# EAGLE design pc-link (EAGLE 9.1.3)
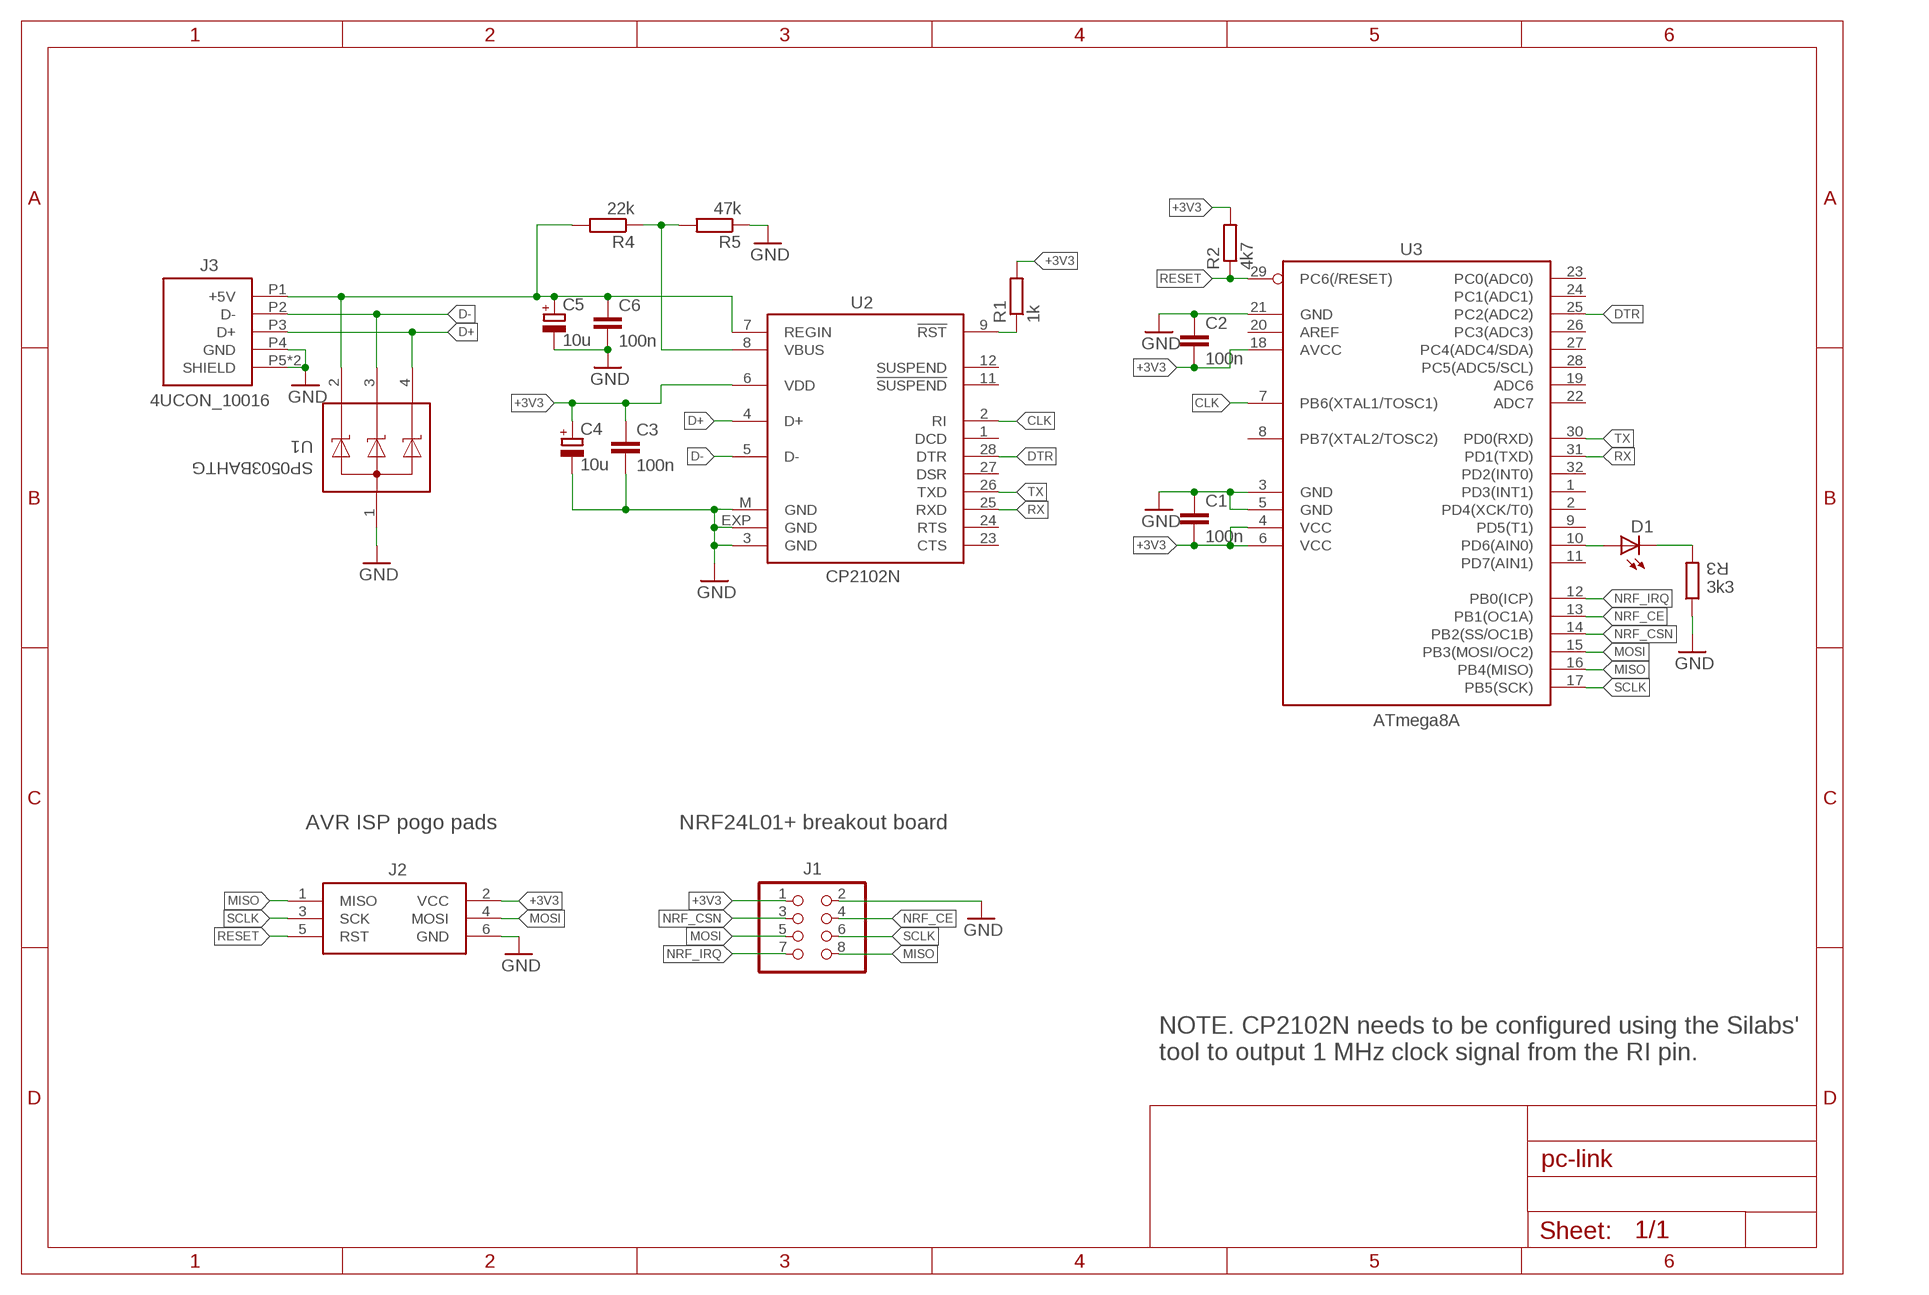
[diagram p0: schematic, sheet 1]

## Parts
C1  100n  C-EUC0805  [C0805]
C2  100n  C-EUC0805  [C0805]
C3  100n  C-EUC0805  [C0805]
C4  10u  CPOL-EUCT3216  [CT3216]
C5  10u  CPOL-EUCT3216  [CT3216]
C6  100n  C-EUC0805  [C0805]
D1  LEDSMT1206  [1206]
J1  PINHD-2X4  [2X04]
J2  POGO_AVR_ISP6  [POGO_AVR_ISP6]
J3  4UCON_10016  USB_A_4UCON_10016  [USB_A_4UCON_10016]
R1  1k  R-EU_R0805  [R0805]
R2  4k7  R-EU_R0805  [R0805]
R3  3k3  R-EU_R0805  [R0805]
R4  22k  R-EU_R0805  [R0805]
R5  47k  R-EU_R0805  [R0805]
U1  SP0503BAHTG  [SOT143]
U2  CP2102N  CP2102  [MLP28]
U3  ATmega8A  MEGA8-AI  [TQFP32-08]

## Nets
+3V3: C1.2 C2.2 C3.1 C4.+ J1.1 J2.2(VCC) R1.2 R2.2 U2.6(VDD) U3.4(VCC) U3.6(VCC) U3.18(AVCC)
+5V: C5.+ C6.1 J3.P1(+5V) R4.2 U1.2 U2.7(REGIN)
CLK: U2.2(RI) U3.7(PB6(XTAL1/TOSC1))
D+: J3.P3(D+) U1.4 U2.4(D+)
D-: J3.P2(D-) U1.3 U2.5(D-)
DTR: U2.28(DTR) U3.25(PC2(ADC2))
GND: C1.1 C2.1 C3.2 C4.- C5.- C6.2 J1.2 J2.6(GND) J3.P4(GND) J3.P5(SHIELD) J3.P6(SHIELD) R3.1 R5.1 U1.1 U2.3(GND) U2.EXP(GND) U2.M(GND) U3.3(GND) U3.5(GND) U3.21(GND)
MISO: J1.8 J2.1(MISO) U3.16(PB4(MISO))
MOSI: J1.5 J2.4(MOSI) U3.15(PB3(MOSI/OC2))
N$1: R1.1 U2.9(!RST)
N$2: D1.C R3.2
N$4: D1.A U3.10(PD6(AIN0))
N$5: R4.1 R5.2 U2.8(VBUS)
NRF_CE: J1.4 U3.13(PB1(OC1A))
NRF_CSN: J1.3 U3.14(PB2(SS/OC1B))
NRF_IRQ: J1.7 U3.12(PB0(ICP))
RESET: J2.5(RST) R2.1 U3.29(PC6(/RESET))
RX: U2.25(RXD) U3.31(PD1(TXD))
SCLK: J1.6 J2.3(SCK) U3.17(PB5(SCK))
TX: U2.26(TXD) U3.30(PD0(RXD))
Unconnected: U2.1(DCD) U2.11(!SUSPEND) U2.12(SUSPEND) U2.23(CTS) U2.24(RTS) U2.27(DSR) U3.1(PD3(INT1)) U3.2(PD4(XCK/T0)) U3.8(PB7(XTAL2/TOSC2)) U3.9(PD5(T1)) U3.11(PD7(AIN1)) U3.19(ADC6) U3.20(AREF) U3.22(ADC7) U3.23(PC0(ADC0)) U3.24(PC1(ADC1)) U3.26(PC3(ADC3)) U3.27(PC4(ADC4/SDA)) U3.28(PC5(ADC5/SCL)) U3.32(PD2(INT0))

## Notes on the sheet
- AVR ISP pogo pads | NRF24L01+ breakout board
- NOTE. CP2102N needs to be configured using the Silabs'
  tool to output 1 MHz clock signal from the RI pin.

## Library data of the parts
C1-C3 C6 = rcl:C-EU: CAPACITOR, European symbol; SPICEPREFIX: C
C4 C5 = rcl:CPOL-EU: POLARIZED CAPACITOR, European symbol; SPICEPREFIX: C
D1 = led:LED: LED OSRAM: - CHIPLED LG R971, LG N971, LY N971, LG Q971, LY Q971, LO R971, LY R971 LH N974, LH R974 LS Q976, LO Q976, LY Q976 LO Q996 - Hyper CHIPLED LW Q18S LB Q993, LB Q99A, LB R99A - SideLED LS A670, LO A670, LY A670, LG A670, LP A670 LB A673, LV A673, LT A673, LW A673 LH A674 LY A675 LS A676, LA A676, LO A676, LY A676, LW A676 LS A679, LY A679, LG A679 - Hyper Micro SIDELED® LS Y876, LA Y876, LO Y876, LY Y876 LT Y87S - SmartLED LW L88C, LW L88S LB L89C, LB L89S, LG L890 LS L89K, LO L89K, LY L89K LS L896, LA L896, LO L896, LY L896 - TOPLED LS T670, LO T670, LY T670, LG T670, LP T670 LSG T670, LSP T670, LSY T670, LOP T670, LYG T670 LG T671, LOG T671, LSG T671 LB T673, LV T673, LT T673, LW T673 LH T674 LS T676, LA T676, LO T676, LY T676, LB T676, LH T676, LSB T676, LW T676 LB T67C, LV T67C, LT T67C, LS T67K, LO T67K, LY T67K, LW E67C LS E67B, LA E67B, LO E67B, LY E67B, LB E67C, LV E67C, LT E67C LW T67C LS T679, LY T679, LG T679 LS T770, LO T770, LY T770, LG T770, LP T770 LB T773, LV T773, LT T773, LW T773 LH T774 LS E675, LA E675, LY E675, LS T675 LS T776, LA T776, LO T776, LY T776, LB T776 LHGB T686 LT T68C, LB T68C - Hyper Mini TOPLED® LB M676 - Mini TOPLED Santana® LG M470 LS M47K, LO M47K, LY M47K Source: http://www.osram.convergy.de LUXEON: - LUMILED® LXK2-PW12-R00, LXK2-PW12-S00, LXK2-PW14-U00, LXK2-PW14-V00 LXK2-PM12-R00, LXK2-PM12-S00, LXK2-PM14-U00 LXK2-PE12-Q00, LXK2-PE12-R00, LXK2-PE12-S00, LXK2-PE14-T00, LXK2-PE14-U00 LXK2-PB12-K00, LXK2-PB12-L00, LXK2-PB12-M00, LXK2-PB14-N00, LXK2-PB14-P00, LXK2-PB14-Q00 LXK2-PR12-L00, LXK2-PR12-M00, LXK2-PR14-Q00, LXK2-PR14-R00 LXK2-PD12-Q00, LXK2-PD12-R00, LXK2-PD12-S00 LXK2-PH12-R00, LXK2-PH12-S00 LXK2-PL12-P00, LXK2-PL12-Q00, LXK2-PL12-R00 Source: www.luxeon.com KINGBRIGHT: KA-3528ASYC Source: www.kingbright.com
J1 = pinhead:PINHD-2X4: PIN HEADER
J2 = my:POGO_AVR_ISP6
J3 = my:USB_A_4UCON_10016
R1-R5 = rcl:R-EU_: RESISTOR, European symbol; SPICEPREFIX: R
U1 = my:SP0503BAHTG
U2 = silabs:CP210*: Single-Chip USB to UART Bridge Source: www.silabs.com .. CP2101.pdf / cp2102.pdf; MF: FARNELL; MPN: CP2102-GM; OC_FARNELL: 9282130; OC_NEWARK: 30K5635
U3 = atmel:MEGA8: MICROCONTROLLER 8 Kbytes FLASH, 1 kbytes SRAM, 512 bytes EEPROM, USART, 6-channel 10 bit ADC, 2-channel 8 bit ADC Pin compatible with Atmega48, ATMega88, ATMega168 Source: avr.lbr; MPN: ATMEGA8-16AU; OC_FARNELL: 9171371; OC_NEWARK: 73M8863

## Board
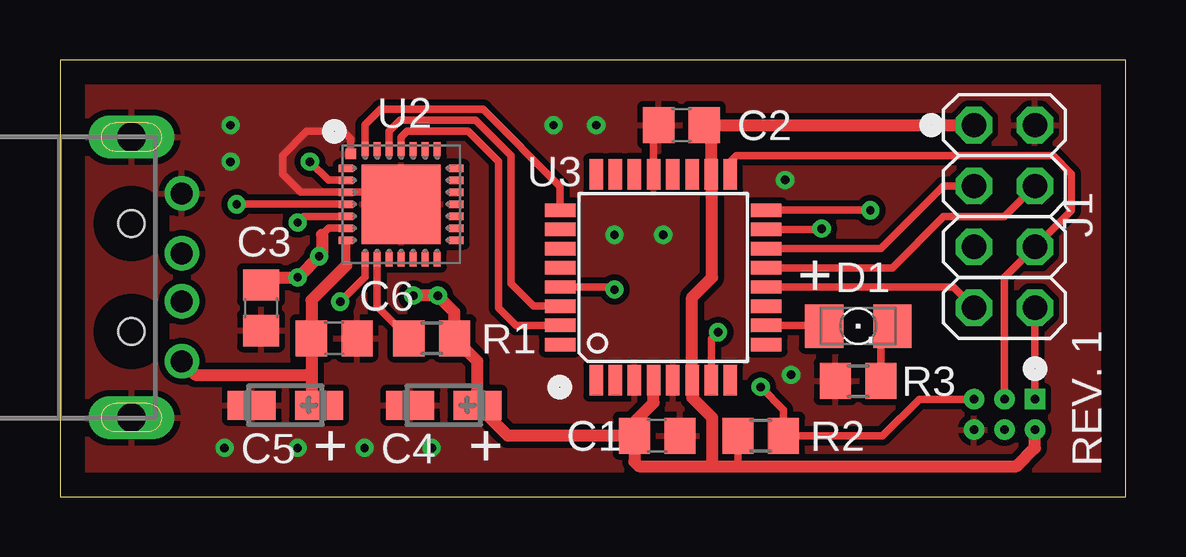
[diagram p1: board, top side]
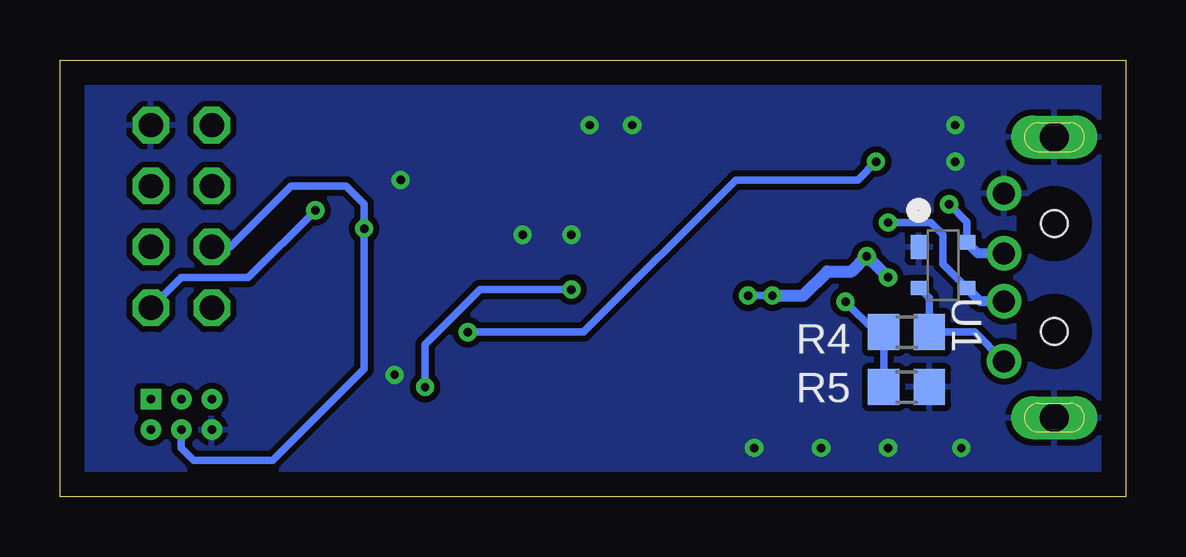
[diagram p2: board, bottom side, seen from below]

Size 44.43 x 18.21 mm. Coordinates in mm from the lower left corner, seen from the top.
Outline: 0,0 44.43,0 44.43,18.21 0,18.21 0,0
Copper layers (1*16): Top 0.035mm / dielectric 1.5mm / Bottom 0.035mm
Design rules "default": minimum track width 6mil, minimum drill 0.35mm, track to track 6mil, track to pad 6mil, pad to pad 6mil, via to via 6mil, smd to smd 6mil, copper to edge 40mil, drill to drill 6mil, minimum pad ring 10mil, minimum via ring 8mil, stop-mask expansion 4mil, vias tented up to drill 0mil, thermal gap 10mil

### Footprints (pad centres in the part's own frame; a part is rotated, then mirrored left to right if it is on the bottom)
C0805 = smd 1.3 x 1.5: 1 -0.95,0; 2 0.95,0
CT3216 = smd 2 x 1.2: + -1.4,0; - 1.4,0
1206 = smd 1.6 x 1.803: A -1.422,0; C 1.422,0
2X04 = drill 1.016 octagon: 1 -3.81,-1.27; 2 -3.81,1.27; 3 -1.27,-1.27; 4 -1.27,1.27; 5 1.27,-1.27; 6 1.27,1.27; 7 3.81,-1.27; 8 3.81,1.27
POGO_AVR_ISP6 = drill 0.35 square: 1 0,0 | drill 0.35: 2 1.27,0; 3 0,-1.27; 4 1.27,-1.27; 5 0,-2.54; 6 1.27,-2.54
USB_A_4UCON_10016 = drill 0.92: P1 -3.5,0; P2 -1,0; P3 1,0; P4 3.5,0 | drill 1.2 long: P5 -5.85,2.1; P6 5.85,2.1 | hole 1.1: 2.25,2.1; -2.25,2.1
R0805 = smd 1.3 x 1.5: 1 -0.95,0; 2 0.95,0
SOT143 = smd 1 x 0.7: 1 -0.75,-1 | smd 0.6 x 0.7: 2 0.95,-1; 3 0.95,1; 4 -0.95,1
MLP28 = smd 0.6 x 0.3: 1 -2.3,1.5; 2 -2.3,1; 3 -2.3,0.5; 4 -2.3,0; 5 -2.3,-0.5; 6 -2.3,-1; 7 -2.3,-1.5; 15 2.3,-1.5; 16 2.3,-1; 17 2.3,-0.5; 18 2.3,0; 19 2.3,0.5; 20 2.3,1; 21 2.3,1.5 | smd 0.3 x 0.6: 8 -1.5,-2.3; 9 -1,-2.3; 10 -0.5,-2.3; 11 0,-2.3; 12 0.5,-2.3; 13 1,-2.3; 14 1.5,-2.3; 22 1.5,2.3; 23 1,2.3; 24 0.5,2.3; 25 0,2.3; 26 -0.5,2.3; 27 -1,2.3; 28 -1.5,2.3 | smd 3.3 x 3.3: EXP 0,0 | smd 0.435 x 0.435: M -2.103,2.103
TQFP32-08 = smd 1.27 x 0.559: 1 -4.293,2.8; 2 -4.293,2; 3 -4.293,1.2; 4 -4.293,0.4; 5 -4.293,-0.4; 6 -4.293,-1.2; 7 -4.293,-2; 8 -4.293,-2.8; 17 4.293,-2.8; 18 4.293,-2; 19 4.293,-1.2; 20 4.293,-0.4; 21 4.293,0.4; 22 4.293,1.2; 23 4.293,2; 24 4.293,2.8 | smd 0.559 x 1.27: 9 -2.8,-4.293; 10 -2,-4.293; 11 -1.2,-4.293; 12 -0.4,-4.293; 13 0.4,-4.293; 14 1.2,-4.293; 15 2,-4.293; 16 2.8,-4.293; 25 2.8,4.293; 26 2,4.293; 27 1.2,4.293; 28 0.4,4.293; 29 -0.4,4.293; 30 -1.2,4.293; 31 -2,4.293; 32 -2.8,4.293

### Placement (x,y rotation side)
C1  24.89,2.54 180 top
C2  25.91,15.49 0 top
C3  8.38,7.87 270 top
C4  16,3.81 180 top
C5  9.4,3.81 180 top
C6  11.43,6.6 0 top
D1  33.27,7.11 0 top
J1  39.37,11.68 270 top
J2  40.64,4.06 270 top
J3  5.08,9.14 90 top
R1  15.49,6.6 0 top
R2  29.21,2.54 180 top
R3  33.27,4.83 0 top
R4  9.14,6.86 0 bottom
R5  9.14,4.57 180 bottom
U1  7.62,9.65 270 bottom
U2  14.22,12.19 0 top
U3  25.15,9.14 90 top

### Tracks (layer width: path | path; a pad name or v marks a point on that pad's centre or on a via)
+3V3  (via drill 0.35)
  Top 0.305: 27.15,15.21 C2.2 | 27.18,13.4 U3.18 | v9.92,9.14 v9.91,9.14 | U2.6 11.19,11.19 10.92,10.92 | 10.92,10.15 v10.8,10.03 | R2.2 28.26,1.34 28.19,1.27
  Top 0.508: U3.18 27.15,15.21 | C1.2 18.67,2.54 C4.+ 17.4,5.65 R1.2 16.44,7.69 v15.75,8.38 v14.73,8.38 | 27.18,13.4 27.18,9.14 26.35,8.31 U3.6 26.35,4.13 27.18,3.3 27.18,1.27 | C1.2 23.94,1.46 24.13,1.27 27.18,1.27 | 27.18,1.27 28.19,1.27 39.88,1.27 40.64,2.03 J2.2 | C2.2 J1.1 | v10.8,10.03 v9.92,9.14 | C3.1 8.7,9.14 v9.91,9.14 | 10.92,10.92 10.92,10.15 | C1.2 23.94,3.11 24.75,3.92 U3.4
  Bottom 0.305: v15.75,8.38 v14.73,8.38 | 10.79,10.03 v10.8,10.03
  Bottom 0.508: v14.73,8.38 13.46,8.38 12.45,9.4 11.43,9.4 v10.8,10.03 | v9.91,9.14 10.79,10.03
+5V
  Top 0.305: U2.7 11.94,10.68 11.94,9.65 | 10.48,4.13 C5.+
  Top 0.508: 11.94,9.65 10.48,8.19 C6.1 10.48,5.08 | 10.48,5.08 10.48,4.13 | J3.P1 5.64,5.08 10.48,5.08
  Bottom 0.305: J3.P1 6.29,6.86 R4.2 8.19,8.28 U1.2
CLK  (via drill 0.35)
  Top 0.305: v27.43,6.86 27.15,6.57 U3.7 | U2.2 11.19,13.19 v10.41,13.97
  Bottom 0.305: v27.43,6.86 22.61,6.86 16.26,13.21 11.18,13.21 v10.41,13.97
D+  (via drill 0.35)
  Top 0.305: v7.37,12.19 U2.4
  Bottom 0.305: U1.4 6.62,11.45 v7.37,12.19
  Bottom 0.406: J3.P3 6.16,10.14 U1.4
D-  (via drill 0.35)
  Top 0.305: U2.5 10.16,11.68 v9.91,11.43
  Bottom 0.305: U1.3 7.62,9.7 7.62,10.92 8.13,11.43 v9.91,11.43
  Bottom 0.406: J3.P2 6.06,8.14 U1.3
DTR
  Top 0.305: U2.28 12.72,15.52 13.36,16.15 17.63,16.15 20.85,12.93 U3.25
GND  (via drill 0.35)
  Top 0.305: 24.75,15.28 C2.1 24.75,15.28 | U2.EXP 13.72,12.69 U2.3 10.04,12.69 9.27,13.46 9.27,14.22 10.29,15.24 11.81,15.24 12.12,14.93 U2.M | 24.75,15.28 U3.21
  other vias: 7.11,15.49 9.91,2.03 15.49,2.03 22.35,15.49 30.23,13.21 25.15,10.92 30.48,5.08 12.7,2.03 6.86,2.03 7.11,13.97 20.57,15.49 23.11,10.92
  pour Top (isolate 0.254): 0,0 44.45,0 44.45,18.03 0,18.03
  pour Bottom (isolate 0.254): 0,0 44.45,0 44.45,18.03 0,18.03
MISO  (via drill 0.35)
  Top 0.305: J2.1 J1.8 | U3.16 v33.78,11.94
  Bottom 0.305: v33.78,11.94 36.58,9.14 39.37,9.14 J1.8
MOSI  (via drill 0.35)
  Top 0.305: U3.15 31.72,11.14 v31.75,11.18
  Bottom 0.305: J1.5 37.34,10.41 34.8,12.95 32.51,12.95 31.75,12.19 v31.75,11.18 31.75,5.33 35.56,1.52 38.86,1.52 39.37,2.03 J2.4
N$1
  Top 0.305: R1.1 13.22,7.92 U2.9
N$2
  Top 0.305: R3.2 34.22,6.64 D1.C
N$4
  Top 0.305: U3.10 31.82,7.14 D1.A
N$5  (via drill 0.35)
  Top 0.305: U2.8 12.72,9.17 v11.68,8.13
  Bottom 0.305: v11.68,8.13 10.41,6.86 R4.1 R5.2
NRF_CE
  Top 0.305: U3.13 34.69,9.54 36.83,11.68 39.37,11.68 J1.4
NRF_CSN
  Top 0.305: U3.14 34.22,10.34 36.83,12.95 J1.3
NRF_IRQ
  Top 0.305: U3.12 37.23,8.74 J1.7
RESET  (via drill 0.35)
  Top 0.305: J2.5 35.81,4.06 34.29,2.54 R2.1 30.16,3.62 v29.21,4.57 | v23.11,8.64 23.01,8.74 U3.29
  Bottom 0.305: v29.21,4.57 29.21,6.35 26.92,8.64 v23.11,8.64
RX
  Top 0.305: U2.25 14.22,14.99 14.48,15.24 17.02,15.24 18.29,13.97 18.29,7.87 19.02,7.14 U3.31
SCLK
  Top 0.305: J2.3 39.37,9.14 J1.6 42.16,11.94 42.16,13.46 41.4,14.22 28.19,14.22 27.95,13.98 U3.17
TX
  Top 0.305: U2.26 13.72,15.25 14.17,15.7 17.32,15.7 18.8,14.22 18.8,8.89 19.74,7.94 U3.30

### Text on the board
tNames: + | + | + | REV. 1